# Altium schematic sheet My_STM32_BOARD_MCU_SCH.SchDoc
size A4
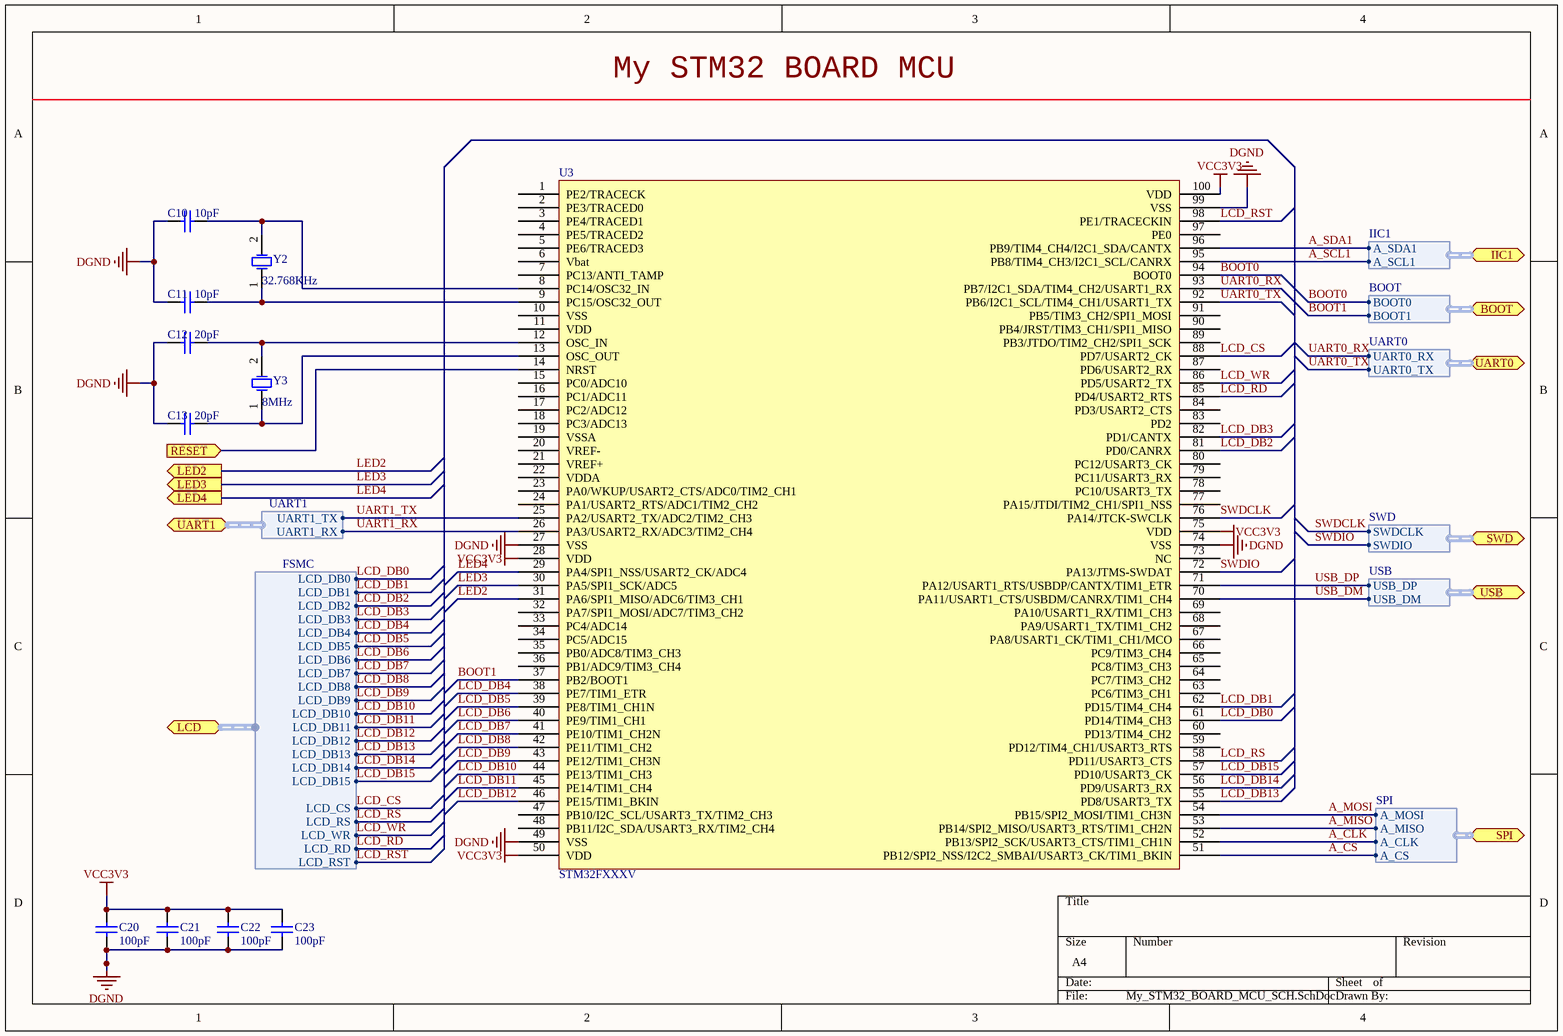
[diagram p0: My_STM32_BOARD_MCU_SCH.SchDoc]

## Parts
C10  value 10pF  [0402]  (hidden comment: Cap Semi)
C11  value 10pF  [0402]  (hidden comment: Cap Semi)
C12  value 20pF  [0402]  (hidden comment: Cap Semi)
C13  value 20pF  [0402]  (hidden comment: Cap Semi)
C20  value 100pF  [0402]  (hidden comment: Cap)
C21  value 100pF  [0402]  (hidden comment: Cap)
C22  value 100pF  [0402]  (hidden comment: Cap)
C23  value 100pF  [0402]  (hidden comment: Cap)
U3  STM32FXXXV  [LQFP-100]
Y2  value 32.768KHz  [XT_XTAL_32K]  (hidden comment: XTAL)
Y3  value 8MHz  [XT_HC49S_D]  (hidden comment: XTAL)

## Ports
BOOT (harness BOOT), IIC1 (harness IIC1), LCD (harness FSMC), LED2 (out), LED3 (out), LED4 (out), RESET (in), SPI (harness SPI), SWD (harness SWD), UART0 (harness UART0), UART1 (harness UART1), USB (harness USB)

## Harnesses
USB: USB_DP, USB_DM
UART1: UART1_TX, UART1_RX
FSMC: LCD_RST, LCD_RD, LCD_WR, LCD_RS, LCD_CS, LCD_DB0, LCD_DB1, LCD_DB2, LCD_DB3, LCD_DB4, LCD_DB5, LCD_DB6, LCD_DB7, LCD_DB8, LCD_DB9, LCD_DB10, LCD_DB11, LCD_DB12, LCD_DB13, LCD_DB14, LCD_DB15
SWD: SWDIO, SWDCLK
SPI: A_CLK, A_MISO, A_MOSI, A_CS
IIC1: A_SCL1, A_SDA1
BOOT: BOOT1, BOOT0
UART0: UART0_TX, UART0_RX

## Nets
DGND: C10.1 C11.1 C12.1 C13.1 C20.1 C21.1 C22.1 C23.1 U3.27(VSS) U3.49(VSS) U3.74(VSS) U3.99(VSS)
VCC3V3: C20.2 C21.2 C22.2 C23.2 U3.28(VDD) U3.50(VDD) U3.75(VDD) U3.100(VDD)
A_CLK: U3.52(PB13/SPI2_SCK/USART3_CTS/TIM1_CH1N) ; port SPI.A_CLK
A_CS: U3.51(PB12/SPI2_NSS/I2C2_SMBAI/USART3_CK/TIM1_BKIN) ; port SPI.A_CS
A_MISO: U3.53(PB14/SPI2_MISO/USART3_RTS/TIM1_CH2N) ; port SPI.A_MISO
A_MOSI: U3.54(PB15/SPI2_MOSI/TIM1_CH3N) ; port SPI.A_MOSI
A_SCL1: U3.95(PB8/TIM4_CH3/I2C1_SCL/CANRX) ; port IIC1.A_SCL1
A_SDA1: U3.96(PB9/TIM4_CH4/I2C1_SDA/CANTX) ; port IIC1.A_SDA1
BOOT0: U3.94(BOOT0) ; port BOOT.BOOT0
BOOT1: U3.37(PB2/BOOT1) ; port BOOT.BOOT1
LCD_CS: U3.88(PD7/USART2_CK) ; port LCD.LCD_CS
LCD_DB0: U3.61(PD14/TIM4_CH3) ; port LCD.LCD_DB0
LCD_DB1: U3.62(PD15/TIM4_CH4) ; port LCD.LCD_DB1
LCD_DB2: U3.81(PD0/CANRX) ; port LCD.LCD_DB2
LCD_DB3: U3.82(PD1/CANTX) ; port LCD.LCD_DB3
LCD_DB4: U3.38(PE7/TIM1_ETR) ; port LCD.LCD_DB4
LCD_DB5: U3.39(PE8/TIM1_CH1N) ; port LCD.LCD_DB5
LCD_DB6: U3.40(PE9/TIM1_CH1) ; port LCD.LCD_DB6
LCD_DB7: U3.41(PE10/TIM1_CH2N) ; port LCD.LCD_DB7
LCD_DB8: U3.42(PE11/TIM1_CH2) ; port LCD.LCD_DB8
LCD_DB9: U3.43(PE12/TIM1_CH3N) ; port LCD.LCD_DB9
LCD_DB10: U3.44(PE13/TIM1_CH3) ; port LCD.LCD_DB10
LCD_DB11: U3.45(PE14/TIM1_CH4) ; port LCD.LCD_DB11
LCD_DB12: U3.46(PE15/TIM1_BKIN) ; port LCD.LCD_DB12
LCD_DB13: U3.55(PD8/USART3_TX) ; port LCD.LCD_DB13
LCD_DB14: U3.56(PD9/USART3_RX) ; port LCD.LCD_DB14
LCD_DB15: U3.57(PD10/USART3_CK) ; port LCD.LCD_DB15
LCD_RD: U3.85(PD4/USART2_RTS) ; port LCD.LCD_RD
LCD_RS: U3.58(PD11/USART3_CTS) ; port LCD.LCD_RS
LCD_RST: U3.98(PE1/TRACECKIN) ; port LCD.LCD_RST
LCD_WR: U3.86(PD5/USART2_TX) ; port LCD.LCD_WR
LED2: U3.31(PA6/SPI1_MISO/ADC6/TIM3_CH1) ; port LED2
LED3: U3.30(PA5/SPI1_SCK/ADC5) ; port LED3
LED4: U3.29(PA4/SPI1_NSS/USART2_CK/ADC4) ; port LED4
RESET: U3.14(NRST) ; port RESET
SWDCLK: U3.76(PA14/JTCK-SWCLK) ; port SWD.SWDCLK
SWDIO: U3.72(PA13/JTMS-SWDAT) ; port SWD.SWDIO
UART0_RX: U3.93(PB7/I2C1_SDA/TIM4_CH2/USART1_RX) ; port UART0.UART0_RX
UART0_TX: U3.92(PB6/I2C1_SCL/TIM4_CH1/USART1_TX) ; port UART0.UART0_TX
UART1_RX: U3.26(PA3/USART2_RX/ADC3/TIM2_CH4) ; port UART1.UART1_RX
UART1_TX: U3.25(PA2/USART2_TX/ADC2/TIM2_CH3) ; port UART1.UART1_TX
USB_DM: U3.70(PA11/USART1_CTS/USBDM/CANRX/TIM1_CH4) ; port USB.USB_DM
USB_DP: U3.71(PA12/USART1_RTS/USBDP/CANTX/TIM1_ETR) ; port USB.USB_DP
NetC10_2: C10.2 U3.8(PC14/OSC32_IN) Y2.2
NetC11_2: C11.2 U3.9(PC15/OSC32_OUT) Y2.1
NetC12_2: C12.2 U3.12(OSC_IN) Y3.2
NetC13_2: C13.2 U3.13(OSC_OUT) Y3.1

Not connected (* = marked no-connect by the designer): U3 1(PE2/TRACECK) 2(PE3/TRACED0) 3(PE4/TRACED1) 4(PE5/TRACED2) 5(PE6/TRACED3) 6(Vbat) 7(PC13/ANTI_TAMP) 10(VSS) 11(VDD) 15(PC0/ADC10) 16(PC1/ADC11) 17(PC2/ADC12) 18(PC3/ADC13) 19(VSSA) 20(VREF-) 21(VREF+) 22(VDDA) 23(PA0/WKUP/USART2_CTS/ADC0/TIM2_CH1) 24(PA1/USART2_RTS/ADC1/TIM2_CH2) 32(PA7/SPI1_MOSI/ADC7/TIM3_CH2) 33(PC4/ADC14) 34(PC5/ADC15) 35(PB0/ADC8/TIM3_CH3) 36(PB1/ADC9/TIM3_CH4) 47(PB10/I2C_SCL/USART3_TX/TIM2_CH3) 48(PB11/I2C_SDA/USART3_RX/TIM2_CH4) 59(PD12/TIM4_CH1/USART3_RTS) 60(PD13/TIM4_CH2) 63(PC6/TIM3_CH1) 64(PC7/TIM3_CH2) 65(PC8/TIM3_CH3) 66(PC9/TIM3_CH4) 67(PA8/USART1_CK/TIM1_CH1/MCO) 68(PA9/USART1_TX/TIM1_CH2) 69(PA10/USART1_RX/TIM1_CH3) 73(NC) 77(PA15/JTDI/TIM2_CH1/SPI1_NSS) 78(PC10/USART3_TX) 79(PC11/USART3_RX) 80(PC12/USART3_CK) 83(PD2) 84(PD3/USART2_CTS) 87(PD6/USART2_RX) 89(PB3/JTDO/TIM2_CH2/SPI1_SCK) 90(PB4/JRST/TIM3_CH1/SPI1_MISO) 91(PB5/TIM3_CH2/SPI1_MOSI) 97(PE0)

## Notes on the sheet
- My STM32 BOARD MCU

## Library data of the parts
C10-C13 = Cap Semi: Capacitor (Semiconductor SIM Model); Published: 8-Jun-2000; LatestRevisionDate: 29-May-2009; LatestRevisionNote: IPC-7351 Footprint Added.; PackageReference: C1206; Publisher: Altium Limited; PackageDescription: Chip Capacitor
C20-C23 = Cap: Capacitor; Published: 8-Jun-2000; LatestRevisionDate: 17-Jul-2002; LatestRevisionNote: Re-released for DXP Platform.; PackageReference: RAD-0.3; Publisher: Altium Limited; PackageDescription: Radial Cap, Thru-Hole; 2 Leads; 0.3 in Pin Spacing